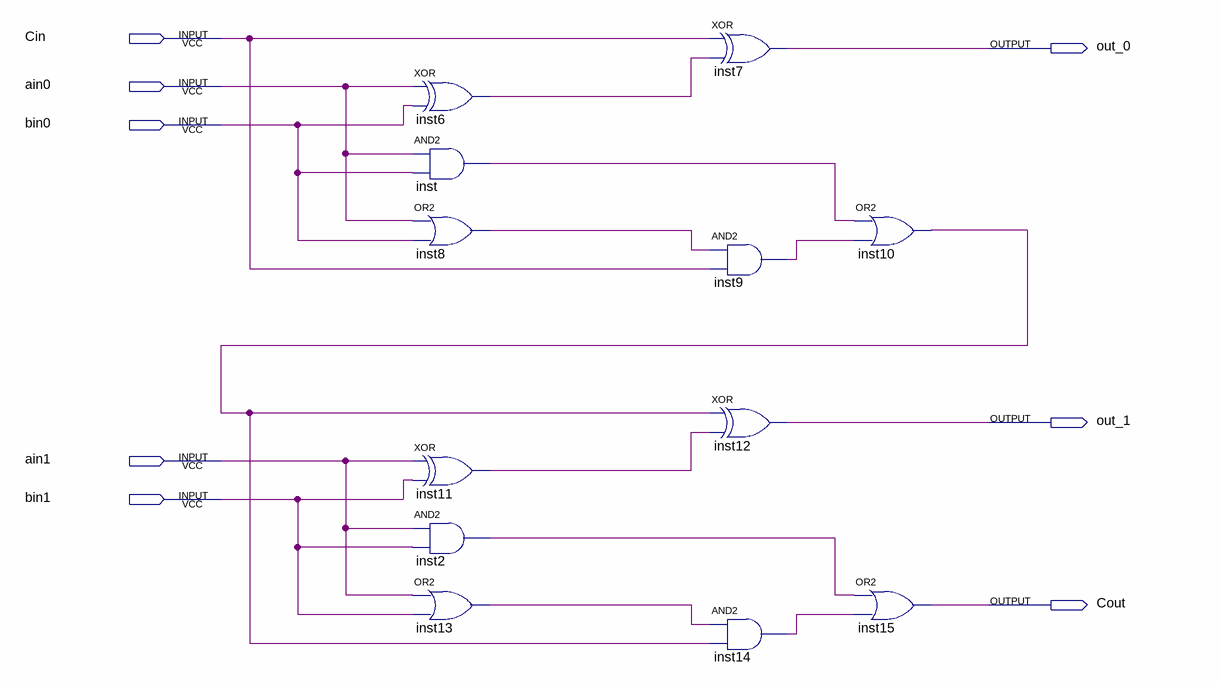
[diagram p0: schematic sheet]
// Quartus schematic somador2bit.bdf as structural Verilog: 12 symbols, 8 pins
module somador2bit (
  input  Cin,
  input  ain0,
  input  bin0,
  input  ain1,
  input  bin1,
  output out_0,
  output out_1,
  output Cout
);

  wire inst2_out, inst6_out, inst8_out, inst9_out, inst10_out, inst11_out, inst13_out, inst14_out, inst_out;

  xor inst6 (inst6_out, ain0, bin0);
  and inst (inst_out, ain0, bin0);
  or inst8 (inst8_out, ain0, bin0);
  xor inst11 (inst11_out, ain1, bin1);
  and inst2 (inst2_out, ain1, bin1);
  or inst13 (inst13_out, ain1, bin1);
  xor inst7 (out_0, Cin, inst6_out);
  and inst9 (inst9_out, inst8_out, Cin);
  xor inst12 (out_1, inst10_out, inst11_out);
  and inst14 (inst14_out, inst13_out, inst10_out);
  or inst10 (inst10_out, inst_out, inst9_out);
  or inst15 (Cout, inst2_out, inst14_out);
endmodule
